# Altium schematic sheet Magnetometer.SchDoc
size A4
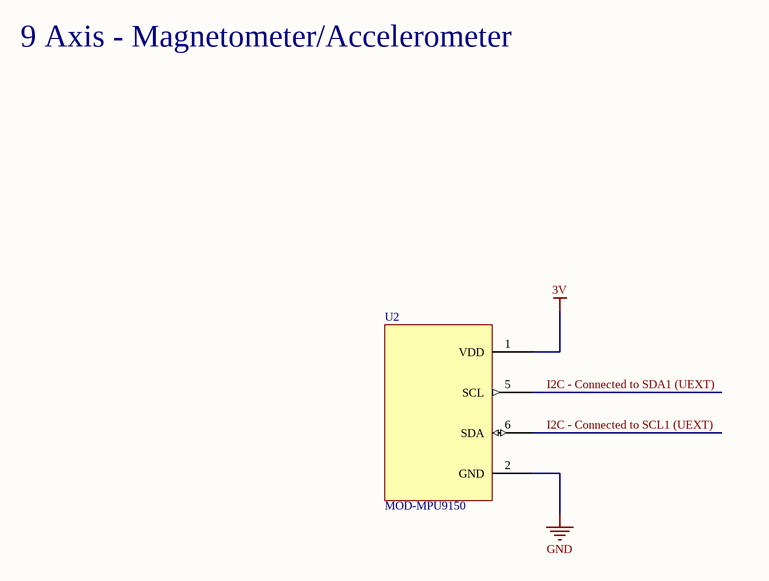
[diagram p0: Magnetometer.SchDoc]

## Parts
U2  MOD-MPU9150

## Nets
3V: U2.1(VDD)
GND: U2.2(GND)
I2C - Connected to SCL1 (UEXT): U2.6(SDA)
I2C - Connected to SDA1 (UEXT): U2.5(SCL)

## Notes on the sheet
- 9 Axis - Magnetometer/Accelerometer

## Library data of the parts
U2 = MOD-MPU9150: 9-Axis; Fabricant: Olimex - InvenSense; Fournisseur: Olimex; RefFabricant: MOD-MPU9150; RefFournisseur: MOD-MPU9150